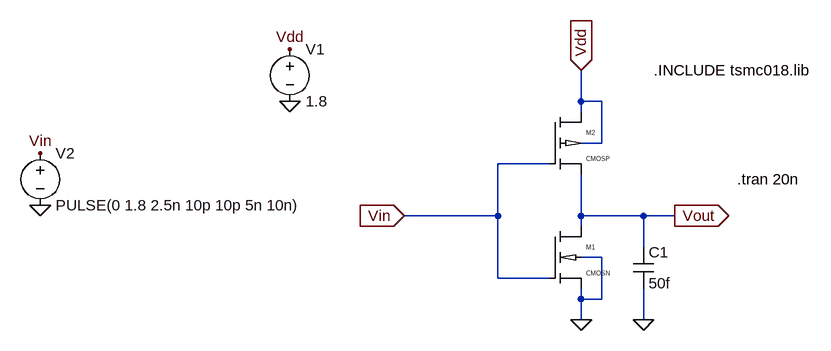
[diagram p0: schematic CMOS2.asc]
CMOS2.asc, the LTspice schematic file:
Version 4
SHEET 1 880 820
WIRE -1376 464 -1376 416
WIRE -1344 464 -1376 464
WIRE -1376 480 -1376 464
WIRE -1344 528 -1344 464
WIRE -1344 528 -1376 528
WIRE -1424 560 -1504 560
WIRE -1504 640 -1504 560
WIRE -1504 640 -1648 640
WIRE -1376 640 -1376 576
WIRE -1280 640 -1376 640
WIRE -1232 640 -1280 640
WIRE -1376 656 -1376 640
WIRE -1280 688 -1280 640
WIRE -1344 704 -1376 704
WIRE -1504 736 -1504 640
WIRE -1424 736 -1504 736
WIRE -1376 768 -1376 752
WIRE -1344 768 -1344 704
WIRE -1344 768 -1376 768
WIRE -1376 800 -1376 768
WIRE -1280 800 -1280 752
FLAG -1376 800 0
FLAG -1376 416 Vdd
IOPIN -1376 416 In
FLAG -1648 640 Vin
IOPIN -1648 640 In
FLAG -1232 640 Vout
IOPIN -1232 640 Out
FLAG -1824 464 0
FLAG -2208 624 0
FLAG -2208 544 Vin
FLAG -1824 384 Vdd
FLAG -1280 800 0
SYMBOL Ncmos -1424 656 R0
SYMATTR InstName M1
SYMATTR Value2 l=180n w=400n
SYMBOL Pcmos -1424 480 R0
SYMATTR InstName M2
SYMATTR Value2 l=180n w=800n
SYMBOL voltage -1824 368 R0
WINDOW 123 0 0 Left 0
WINDOW 39 0 0 Left 0
SYMATTR InstName V1
SYMATTR Value 1.8
SYMBOL voltage -2208 528 R0
WINDOW 123 0 0 Left 0
WINDOW 39 0 0 Left 0
SYMATTR InstName V2
SYMATTR Value PULSE(0 1.8 2.5n 10p 10p 5n 10n)
SYMBOL cap -1296 688 R0
SYMATTR InstName C1
SYMATTR Value 50f
TEXT -1264 416 Left 2 !.INCLUDE tsmc018.lib
TEXT -1136 584 Left 2 !.tran 20n

The netlist it stands for:
* CMOS2.asc
M1 Vout Vin 0 0 CMOSN l=180n w=400n
M2 Vdd Vin Vout Vdd CMOSP l=180n w=800n
V1 Vdd 0 1.8
V2 Vin 0 PULSE(0 1.8 2.5n 10p 10p 5n 10n)
C1 Vout 0 50f
.model NMOS NMOS
.model PMOS PMOS
.lib standard.mos
.INCLUDE tsmc018.lib
.tran 20n
.lib tsmc018.lib
.backanno
.end